# Altium schematic sheet VoltageAmplifier.SchDoc
size B
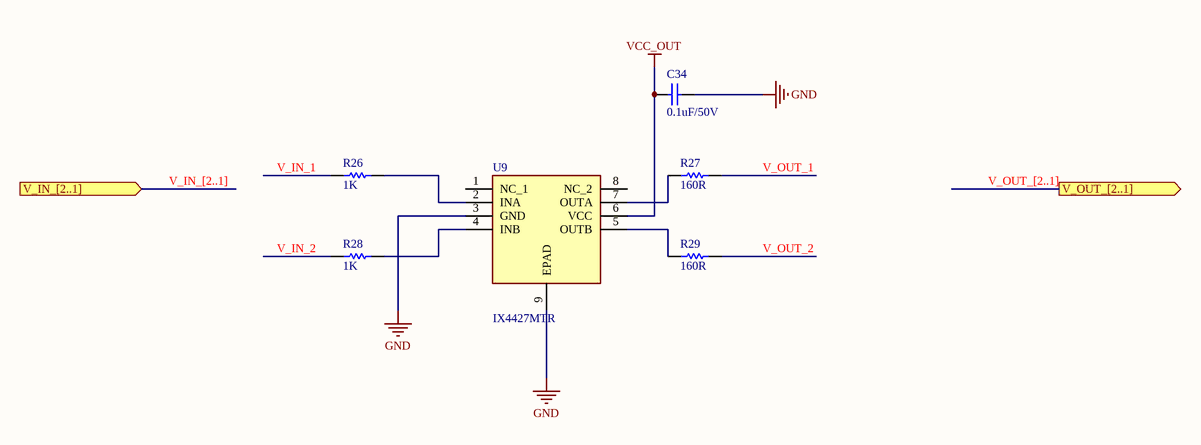
[diagram p0: VoltageAmplifier.SchDoc]

## Parts
C34  0.1uF/50V  [0603C]
R26  1K  [0603R]
R27  160R  [0603R]
R28  1K  [0603R]
R29  160R  [0603R]
U9  IX4427MTR  [IX4427MTR]

## Ports
V_IN_[2..1] (in), V_OUT_[2..1] (out)

## Nets
GND: C34.2 U9.3(GND) U9.9(EPAD)
VCC_OUT: C34.1 U9.6(VCC)
V_IN_1: R26.1
V_IN_2: R28.1
V_OUT_1: R27.2
V_OUT_2: R29.2
NetR26_2: R26.2 U9.2(INA)
NetR27_1: R27.1 U9.7(OUTA)
NetR28_2: R28.2 U9.4(INB)
NetR29_1: R29.1 U9.5(OUTB)

Not connected (* = marked no-connect by the designer): U9 1(NC_1) 8(NC_2)

## Buses and harness runs
bus V_IN_[2..1] = port V_IN_[2..1]
bus V_OUT_[2..1] = port V_OUT_[2..1]

## Library data of the parts
C34 = Cap: Multilayer Ceramic Capacitors MLCC - SMD/SMT 50V 0.1uF 0603 X7R 20%; Mfr: KEMET; Mfr Part No: C0603C104M5RACTU; Package: 0603; Price: 0.101; Stockiest: MOUSER; Stockiest Part No: 80-C0603C104M5R; Value: 0.1uF/50V
R26 R28 = Res1: Resistor; Mfr: Vishay / Dale; Mfr Part No: CRCW06031K00FKEAC; Package: 0603; Price: 0.1; Stockiest: MOUSER; Stockiest Part No: 71-CRCW06031K00FKEAC; Value: 1K
R27 R29 = Res1: Thick Film Resistors - SMD 1/10watt 160ohms 1%; Mfr: Vishay / Dale; Mfr Part No: CRCW0603160RFKEA; Package: 0603; Price: 0.1; Stockiest: MOUSER; Stockiest Part No: 71-CRCW0603-160-E3; Value: 160R
U9 = IX4427MTR: Gate Drivers Dual 1.5A Low Side Gate Driver; Mfr: IXYS Integrated Circuits; Mfr Part No: IX4427MTR; Price: 0.97; Stockiest: MOUSER; Stockiest Part No: 849-IX4427MTR